# Altium project ATRACK_PILOT_V2.PrjPCB
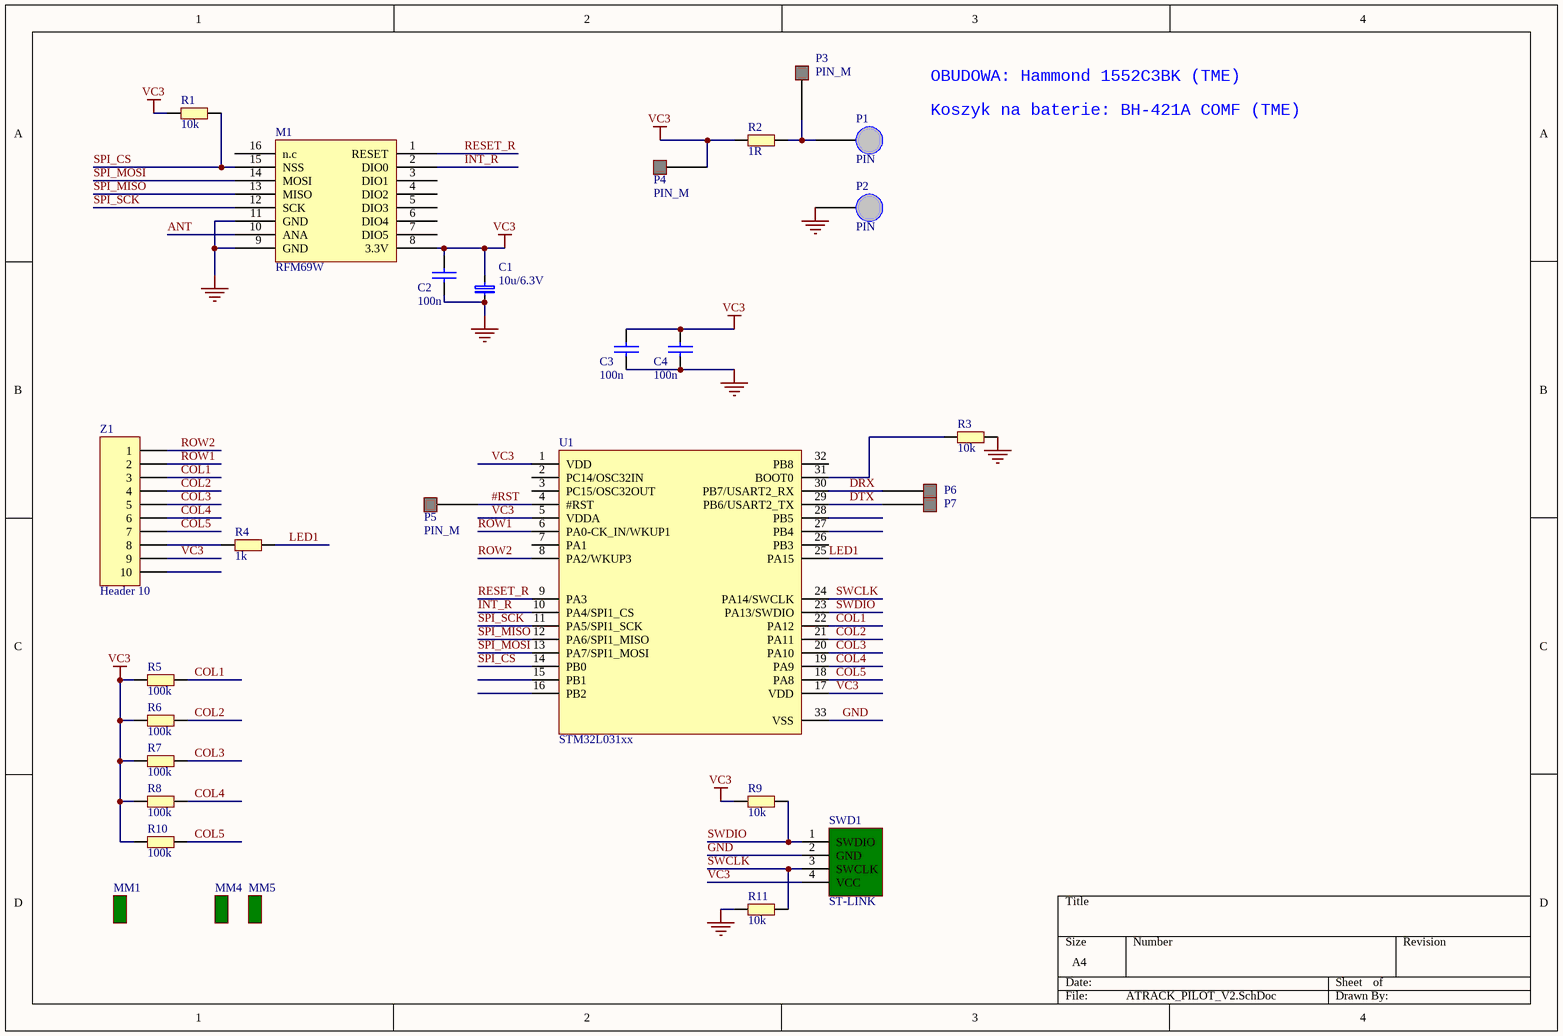
[diagram p0: ATRACK_PILOT_V2.SchDoc]
1 sheet, 29 parts. Net scope: global (net labels, ports and power ports of the same name join across sheets).
Board file: ATRACK_PILOT_V2.PcbDoc

## Sheet ATRACK_PILOT_V2.SchDoc
size A4

### Parts
C1  10u/6.3V  [CAP_A]
C2  100n  [0603C]
C3  100n  [0603C]
C4  100n  [0603C]
M1  RFM69W  [RFM69W]
MM1  (no value)  [REF_CIR]
MM4  (no value)  [REF_SQR]
MM5  (no value)  [PB_FREE_GRAF]
P1  PIN  [PP_PICO6]
P2  PIN  [PP_PICO6]
P3  PIN_M  [PP_SMD1]
P4  PIN_M  [PP_SMD1]
P5  PIN_M  [PP_SMD1]
P6  PIN_M  [PP_SMD1]  (value not drawn)
P7  PIN_M  [PP_SMD1]  (value not drawn)
R1  10k  [0603R]
R2  1R  [0603R]
R3  10k  [0603R]
R4  1k  [0603R]
R5  100k  [0603R]
R6  100k  [0603R]
R7  100k  [0603R]
R8  100k  [0603R]
R9  10k  [0603R]
R10  100k  [0603R]
R11  10k  [0603R]
SWD1  ST-LINK  [PIN4]
U1  STM32L031xx  [UFQFPN32]
Z1  Header 10  [MX-52271-2079]

### Nets
GND: C1.1 C2.1 C3.1 C4.1 M1.9(GND) M1.11(GND) P2.1 R3.1 R11.1 SWD1.2(GND) U1.33(VSS)
VC3: C1.2 C2.2 C3.2 C4.2 M1.8(3.3V) P4.1 R1.2 R2.1 R5.1 R6.1 R7.1 R8.1 R9.1 R10.1 SWD1.4(VCC) U1.1(VDD) U1.5(VDDA) U1.17(VDD) Z1.9
#RST: P5.1 U1.4(#RST)
ANT: M1.10(ANA)
COL1: R5.2 U1.22(PA12) Z1.3
COL2: R6.2 U1.21(PA11) Z1.4
COL3: R7.2 U1.20(PA10) Z1.5
COL4: R8.2 U1.19(PA9) Z1.6
COL5: R10.2 U1.18(PA8) Z1.7
DRX: P6.1 U1.30(PB7/USART2_RX)
DTX: P7.1 U1.29(PB6/USART2_TX)
INT_R: M1.2(DIO0) U1.10(PA4/SPI1_CS)
LED1: R4.1 U1.25(PA15)
RESET_R: M1.1(RESET) U1.9(PA3)
ROW1: U1.6(PA0-CK_IN/WKUP1) Z1.2
ROW2: U1.8(PA2/WKUP3) Z1.1
SPI_CS: M1.15(NSS) R1.1 U1.14(PB0)
SPI_MISO: M1.13(MISO) U1.12(PA6/SPI1_MISO)
SPI_MOSI: M1.14(MOSI) U1.13(PA7/SPI1_MOSI)
SPI_SCK: M1.12(SCK) U1.11(PA5/SPI1_SCK)
SWCLK: R11.2 SWD1.3(SWCLK) U1.24(PA14/SWCLK)
SWDIO: R9.2 SWD1.1(SWDIO) U1.23(PA13/SWDIO)
NetP1_1: P1.1 P3.1 R2.2
NetR3_2: R3.2 U1.31(BOOT0)
NetR4_2: R4.2 Z1.8

Not connected (* = marked no-connect by the designer): M1 3(DIO1) 4(DIO2) 5(DIO3) 6(DIO4) 7(DIO5) 16(n.c); U1 2(PC14/OSC32IN) 3(PC15/OSC32OUT) 7(PA1) 15(PB1) 16(PB2) 26(PB3) 27(PB4) 28(PB5) 32(PB8); Z1 10

### Notes on the sheet
- OBUDOWA: Hammond 1552C3BK (TME)
- Koszyk na baterie: BH-421A COMF (TME)

### Library data of the parts
C1 = CAP_TANTAL_SMD: KONDENSATOR ELEKTROLITYCZNY TANTALOWY SMD
C2-C4 = CAP: Capacitor
M1 = RFM96W
MM1 MM4 MM5 = MECH
R1-R11 = RES3
SWD1 = SW_CON: Header, 4-Pin; LatestRevisionDate: 17-Jul-2002; LatestRevisionNote: Re-released for DXP Platform.; Publisher: Altium Limited
U1 = STM32L031xx/UFQFPN32
Z1 = Header 10: Header, 10-Pin; LatestRevisionDate: 17-Jul-2002; LatestRevisionNote: Re-released for DXP Platform.; Publisher: Altium Limited